# EAGLE schematic dac_cape (EAGLE 6.4)

## Sheet 1 of 2: BB Headers
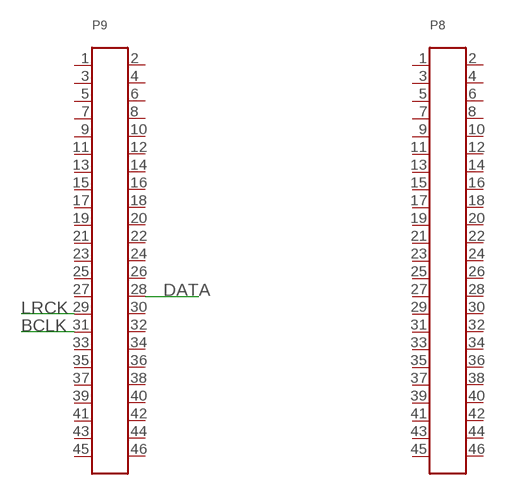
[diagram p0: schematic, sheet 1]

### Parts
P8  PINHD-2X23  [2X23]
P9  PINHD-2X23  [2X23]

### Nets
BCLK: P9.31 ; also sheet 2
DATA: P9.28 ; also sheet 2
LRCK: P9.29 ; also sheet 2
Unconnected: P8.1 P8.2 P8.3 P8.4 P8.5 P8.6 P8.7 P8.8 P8.9 P8.10 P8.11 P8.12 P8.13 P8.14 P8.15 P8.16 P8.17 P8.18 P8.19 P8.20 P8.21 P8.22 P8.23 P8.24 P8.25 P8.26 P8.27 P8.28 P8.29 P8.30 P8.31 P8.32 P8.33 P8.34 P8.35 P8.36 P8.37 P8.38 P8.39 P8.40 P8.41 P8.42 P8.43 P8.44 P8.45 P8.46 P9.1 P9.2 P9.3 P9.4 P9.5 P9.6 P9.7 P9.8 P9.9 P9.10 P9.11 P9.12 P9.13 P9.14 P9.15 P9.16 P9.17 P9.18 P9.19 P9.20 P9.21 P9.22 P9.23 P9.24 P9.25 P9.26 P9.27 P9.30 P9.32 P9.33 P9.34 P9.35 P9.36 P9.37 P9.38 P9.39 P9.40 P9.41 P9.42 P9.43 P9.44 P9.45 P9.46

## Sheet 2 of 2
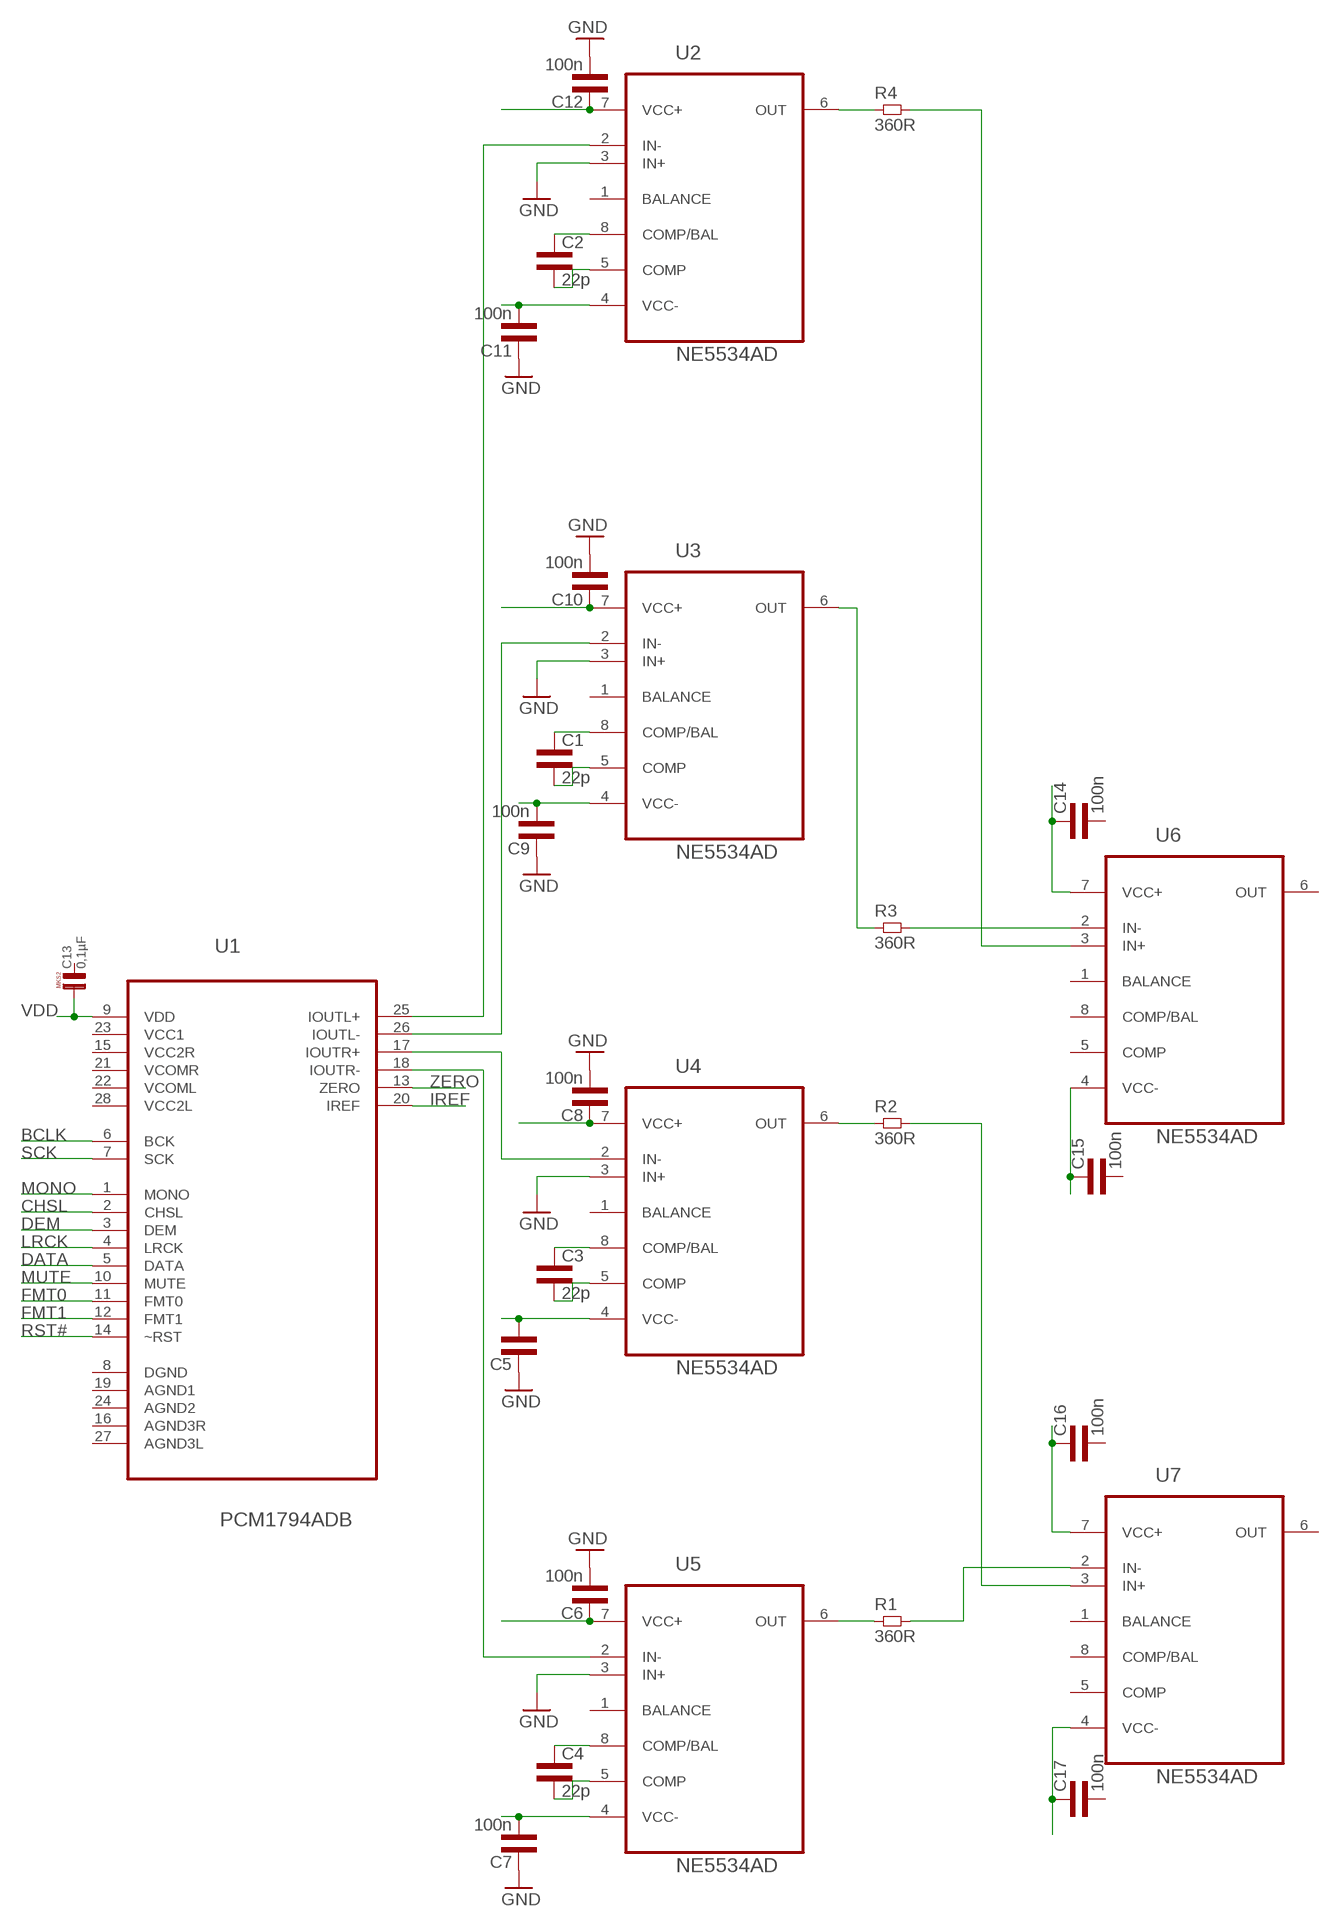
[diagram p1: schematic, sheet 2]

### Parts
C1  22p  CAP0603L3  [0603L3]
C2  22p  CAP0603L3  [0603L3]
C3  22p  CAP0603L3  [0603L3]
C4  22p  CAP0603L3  [0603L3]
C5  CAP0603L3  [0603L3]
C6  100n  CAP0603L3  [0603L3]
C7  100n  CAP0603L3  [0603L3]
C8  100n  CAP0603L3  [0603L3]
C9  100n  CAP0603L3  [0603L3]
C10  100n  CAP0603L3  [0603L3]
C11  100n  CAP0603L3  [0603L3]
C12  100n  CAP0603L3  [0603L3]
C13  0,1µF  [R5B3]
C14  100n  CAP0603L3  [0603L3]
C15  100n  CAP0603L3  [0603L3]
C16  100n  CAP0603L3  [0603L3]
C17  100n  CAP0603L3  [0603L3]
R1  360R  RES0603L3  [0603L3]
R2  360R  RES0603L3  [0603L3]
R3  360R  RES0603L3  [0603L3]
R4  360R  RES0603L3  [0603L3]
U1  PCM1794ADB  [SOP65P780X200-28N]
U2  NE5534AD  [SOIC127P600X175-8N]
U3  NE5534AD  [SOIC127P600X175-8N]
U4  NE5534AD  [SOIC127P600X175-8N]
U5  NE5534AD  [SOIC127P600X175-8N]
U6  NE5534AD  [SOIC127P600X175-8N]
U7  NE5534AD  [SOIC127P600X175-8N]

### Nets
BCLK: U1.6(BCK) ; also sheet 1
CHSL: U1.2(CHSL)
DATA: U1.5(DATA) ; also sheet 1
DEM: U1.3(DEM)
FMT0: U1.11(FMT0)
FMT1: U1.12(FMT1)
GND: C5.P$1 C6.P$2 C7.P$1 C8.P$2 C9.P$1 C10.P$2 C11.P$1 C12.P$2 U2.3(IN+) U3.3(IN+) U4.3(IN+) U5.3(IN+)
IREF: U1.20(IREF)
LRCK: U1.4(LRCK) ; also sheet 1
MONO: U1.1(MONO)
MUTE: U1.10(MUTE)
N$1: U1.26(IOUTL-) U3.2(IN-)
N$2: U1.17(IOUTR+) U4.2(IN-)
N$3: U1.18(IOUTR-) U5.2(IN-)
N$4: U1.25(IOUTL+) U2.2(IN-)
N$5: R3.P$2 U6.2(IN-)
N$6: R1.P$2 U7.2(IN-)
N$7: R4.P$1 U2.6(OUT)
N$8: R3.P$1 U3.6(OUT)
N$9: R4.P$2 U6.3(IN+)
N$10: R2.P$2 U7.3(IN+)
N$11: R2.P$1 U4.6(OUT)
N$12: R1.P$1 U5.6(OUT)
N$13: C3.P$1 U4.8(COMP/BAL)
N$14: C3.P$2 U4.5(COMP)
N$15: C4.P$1 U5.8(COMP/BAL)
N$16: C4.P$2 U5.5(COMP)
N$17: C2.P$1 U2.8(COMP/BAL)
N$18: C2.P$2 U2.5(COMP)
N$19: C1.P$1 U3.8(COMP/BAL)
N$20: C1.P$2 U3.5(COMP)
N$21: C12.P$1 U2.7(VCC+)
N$22: C11.P$2 U2.4(VCC-)
N$23: C10.P$1 U3.7(VCC+)
N$24: C9.P$2 U3.4(VCC-)
N$25: C8.P$1 U4.7(VCC+)
N$26: C5.P$2 U4.4(VCC-)
N$27: C6.P$1 U5.7(VCC+)
N$28: C7.P$2 U5.4(VCC-)
N$29: C14.P$1 U6.7(VCC+)
N$30: C15.P$1 U6.4(VCC-)
N$31: C16.P$1 U7.7(VCC+)
N$32: C17.P$1 U7.4(VCC-)
RST#: U1.14(~RST)
SCK: U1.7(SCK)
VDD: C13.1 U1.9(VDD)
ZERO: U1.13(ZERO)
Unconnected: C13.2 C14.P$2 C15.P$2 C16.P$2 C17.P$2 U1.8(DGND) U1.16(AGND3R) U1.19(AGND1) U1.21(VCOMR) U1.22(VCOML) U1.24(AGND2) U1.27(AGND3L) U2.1(BALANCE) U3.1(BALANCE) U4.1(BALANCE) U5.1(BALANCE) U6.1(BALANCE) U6.5(COMP) U6.6(OUT) U6.8(COMP/BAL) U7.1(BALANCE) U7.5(COMP) U7.6(OUT) U7.8(COMP/BAL)

## Power pins joined to a net without a drawn wire
VCC1: U1.23(VCC1)
VCC2L: U1.28(VCC2L)
VCC2R: U1.15(VCC2R)

## Library data of the parts
C1-C12 C14-C17 = common:CAP
C13 = Capacitor-Wima-MKS2-100v:0,1µF
P8 P9 = pinhead:PINHD-2X23
R1-R4 = common:RES
U1 = Texas Instruments_By_element14_Batch_1:PCM1794ADB: 24-Bit 192khz Sampling advanced segment Audio stereo digital-to-analog converter; MPN: PCM1794ADB; OC_FARNELL: 1755014; OC_NEWARK: 54K0199; PACKAGE: SSOP-28; SUPPLIER: Texas Instruments
U2-U7 = Texas Instruments_By_element14_Batch_1:NE5534AD: LOW-NOISE OPERATIONAL AMPLIFIERS; MPN: NE5534AD; OC_FARNELL: 9589864; OC_NEWARK: 08F2508; PACKAGE: SOIC-8; SUPPLIER: Texas Instruments